# EAGLE design portalgate (EAGLE 7.6.0)
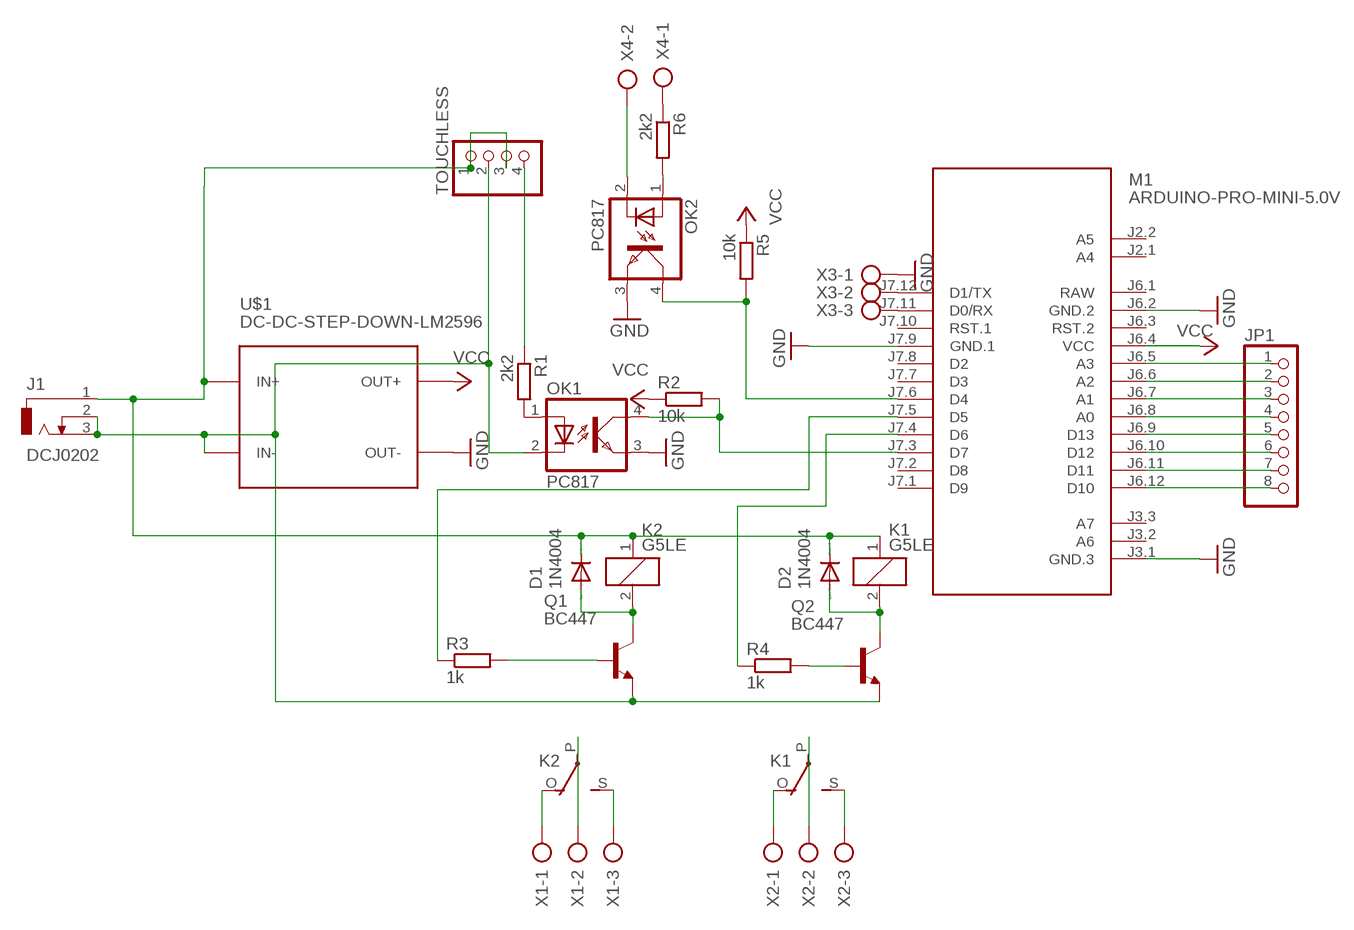
[diagram p0: schematic, sheet 1]

## Parts
D1  1N4004  [DO41-10]
D2  1N4004  [DO41-10]
J1  DCJ0202  [DCJ0202]
JP1  PINHD-1X8  [1X08]
K1  G5LE  [G5LE]
K2  G5LE  [G5LE]
M1  ARDUINO-PRO-MINI-5.0V  [ARDUINO-PRO-MINI]
OK1  PC817  [DIL04]
OK2  PC817  [DIL04]
Q1  BC447  [TO92-EBC]
Q2  BC447  [TO92-EBC]
R1  2k2  R-EU_0204/7  [0204/7]
R2  10k  R-EU_0204/7  [0204/7]
R3  1k  R-EU_0204/7  [0204/7]
R4  1k  R-EU_0204/7  [0204/7]
R5  10k  R-EU_0204/7  [0204/7]
R6  2k2  R-EU_0204/7  [0204/7]
TOUCHLESS  PINHD-1X4  [1X04]
U$1  DC-DC-STEP-DOWN-LM2596  [DC-DC-STEP-DOWN-LM2596]
X1  AK300/3  [AK300/3]
X2  AK300/3  [AK300/3]
X3  AK300/3  [AK300/3]
X4  AK300/2  [AK300/2]

## Nets
+12V: D1.C D2.C J1.1 K1.1 K2.1 TOUCHLESS.1 TOUCHLESS.3 U$1.IN+
GND: M1.J3.1(GND.3) M1.J6.2(GND.2) M1.J7.9(GND.1) OK1.3(EMIT) OK2.3(EMIT) U$1.OUT- X3.1
GND12V: J1.2 J1.3 OK1.2(C) Q1.E Q2.E TOUCHLESS.2 U$1.IN-
N$1: M1.J7.11(D0/RX) X3.3
N$2: M1.J7.12(D1/TX) X3.2
N$3: R1.1 TOUCHLESS.4
N$4: OK1.1(A) R1.2
N$5: D2.A K1.2 Q2.C
N$6: M1.J7.6(D4) OK2.4(COL) R5.2
N$7: M1.J7.5(D5) R3.1
N$8: M1.J7.4(D6) R4.1
N$9: Q1.B R3.2
N$10: JP1.1 M1.J6.5(A3)
N$11: K2.O(2:O) X1.1
N$12: K2.P(2:P) X1.2
N$13: K2.S(2:S) X1.3
N$14: K1.P(2:P) X2.2
N$15: K1.O(2:O) X2.1
N$16: K1.S(2:S) X2.3
N$17: Q2.B R4.2
N$18: D1.A K2.2 Q1.C
N$19: JP1.2 M1.J6.6(A2)
N$20: JP1.3 M1.J6.7(A1)
N$21: JP1.4 M1.J6.8(A0)
N$22: JP1.5 M1.J6.9(D13)
N$23: JP1.6 M1.J6.10(D12)
N$24: JP1.7 M1.J6.11(D11)
N$25: JP1.8 M1.J6.12(D10)
N$26: M1.J7.3(D7) OK1.4(COL) R2.2
N$27: OK2.1(A) R6.2
N$28: R6.1 X4.1
N$29: OK2.2(C) X4.2
VCC: M1.J6.4(VCC) R2.1 R5.1 U$1.OUT+
Unconnected: M1.J2.1(A4) M1.J2.2(A5) M1.J3.2(A6) M1.J3.3(A7) M1.J6.3(RST.2) M1.J7.1(D9) M1.J7.2(D8) M1.J7.7(D3) M1.J7.8(D2) M1.J7.10(RST.1)

## Power pins joined to a net without a drawn wire
RAW: M1.J6.1(RAW)

## Library data of the parts
D1 D2 = diode:1N4004: DIODE general purpose rectifier, 1 A
J1 = con-jack:DCJ0202: DC POWER JACK Source: DCJ0202.pdf; OC_FARNELL: unknown; OC_NEWARK: unknown
JP1 = pinhead:PINHD-1X8: PIN HEADER
K1 K2 = relay:G5LE: RELAY 1 x switch, 10 A/120 V AC, 8 A/30 V DC, Omron; OC_FARNELL: unknown; OC_NEWARK: unknown
M1 = diy-modules:ARDUINO-PRO-MINI-*: Arduino Pro Mini and compatible devices More details available here: https://www.arduino.cc/en/Main/ArduinoBoardProMini Click here to find device on ebay.com <http://www.ebay.com/sch/arduino+pro+mini>
OK1 OK2 = optocoupler:PC817: SHARP OPTO COUPLER; MPN: PC817X4J000F; OC_FARNELL: 9707727; OC_NEWARK: 97K7059
Q1 Q2 = transistor-npn:BC447*: NPN Transistor
R1-R6 = rcl:R-EU_: RESISTOR, European symbol
TOUCHLESS = pinhead:PINHD-1X4: PIN HEADER
U$1 = diy-modules:DC-DC-STEP-DOWN-LM2596: DC/DC Step-Down Regulator based on LM2596-ADJ chip LM2596 datasheet available here: http://www.ti.com/lit/ds/symlink/lm2596.pdf Click here to find device on ebay.com <http://www.ebay.com/sch/lm2596+power+regulator>
X1-X3 = con-ptr500:AK300/3: CONNECTOR; OC_FARNELL: unknown; OC_NEWARK: unknown
X4 = con-ptr500:AK300/2: CONNECTOR; OC_FARNELL: unknown; OC_NEWARK: unknown

## Board
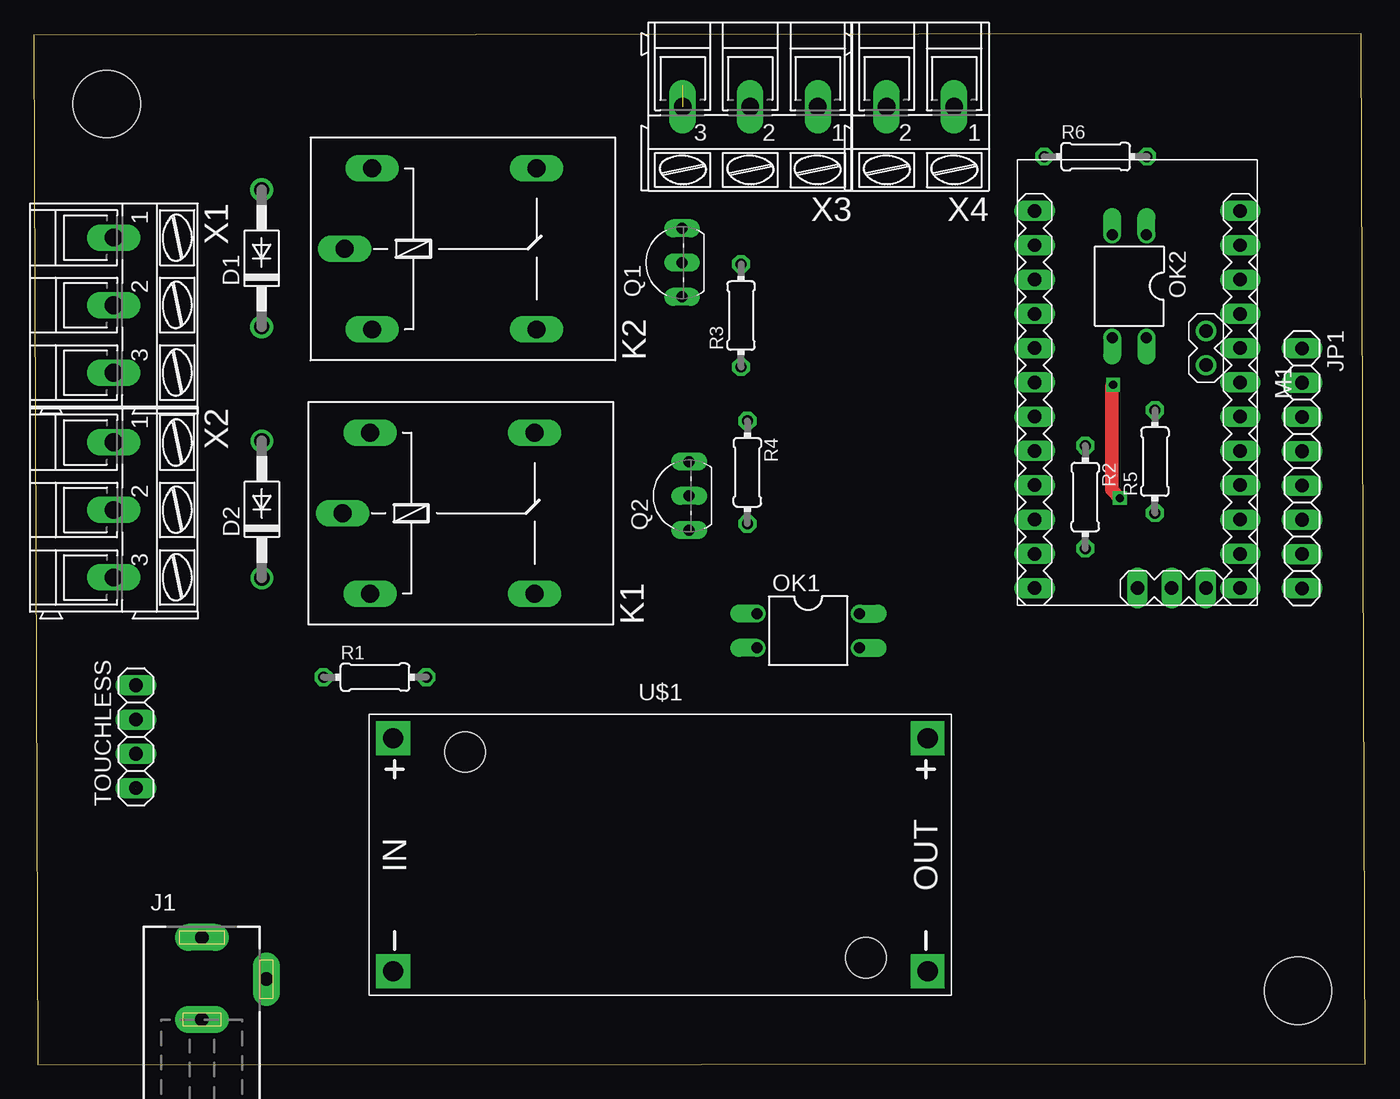
[diagram p1: board, top side]
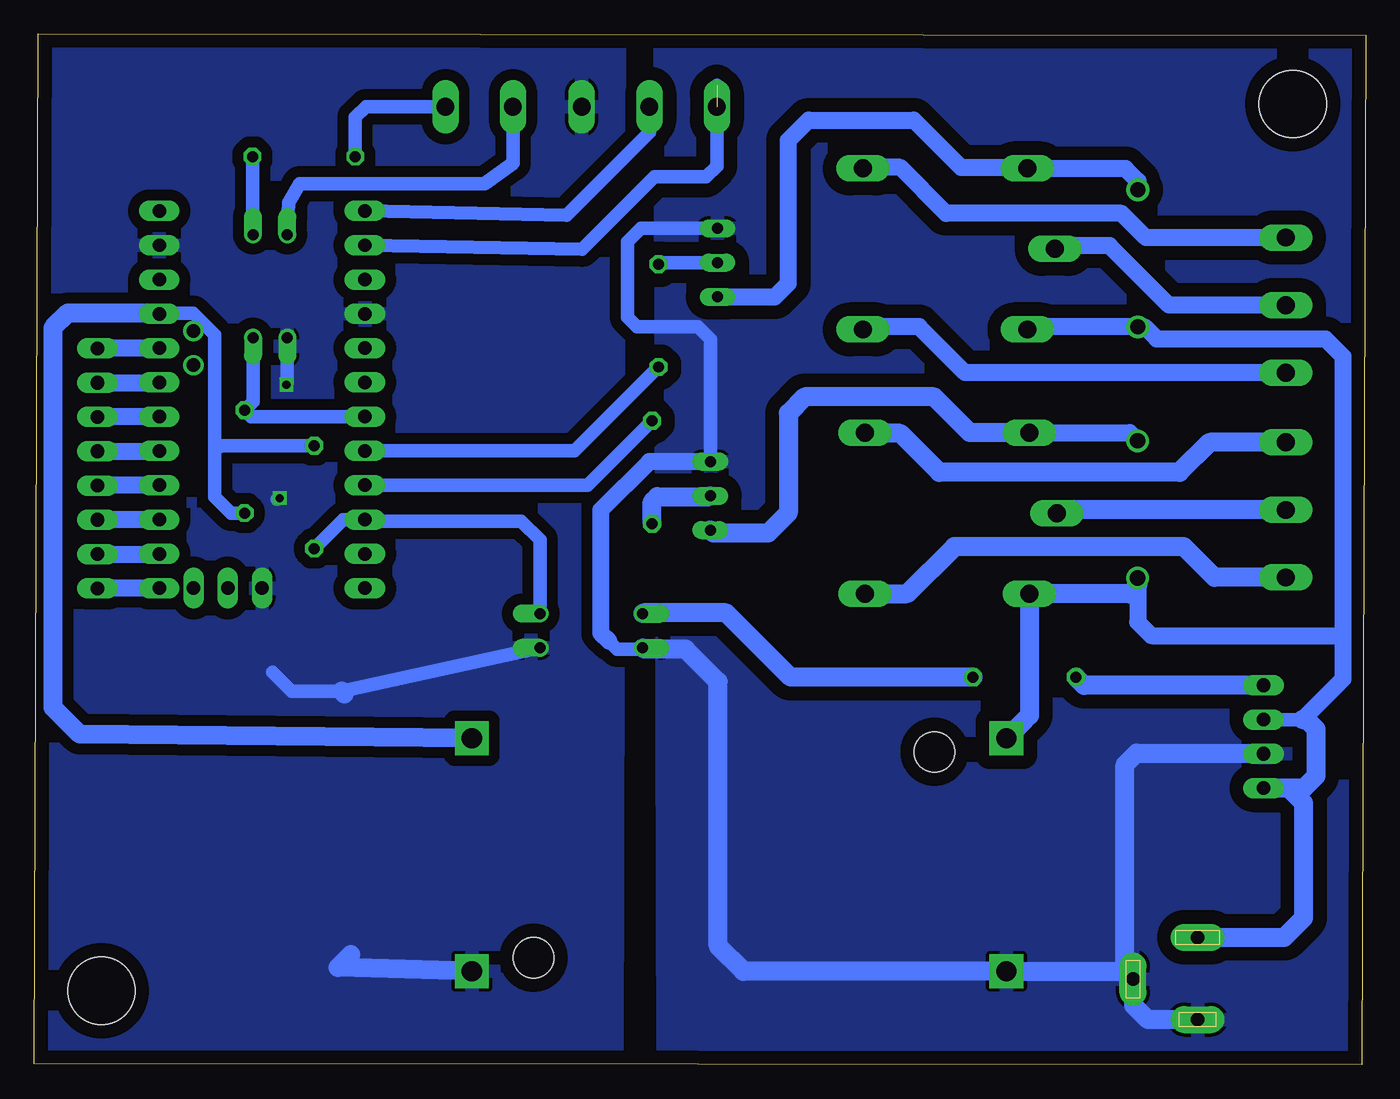
[diagram p2: board, bottom side, seen from below]

Size 98.7 x 76.4 mm. Coordinates in mm from the lower left corner, seen from the top.
Outline: 0.3,0 98.7,0.1 98.4,76.4 0,76.3 0.3,0
Copper layers (1*16): Top 0.035mm / dielectric 1.5mm / Bottom 0.035mm
Design rules "default": minimum track width 10mil, minimum drill 24mil, track to track 8mil, track to pad 8mil, pad to pad 8mil, via to via 8mil, smd to smd 8mil, copper to edge 40mil, drill to drill 8mil, minimum pad ring 10mil, minimum via ring 8mil, stop-mask expansion 4mil, vias tented up to drill 0mil, thermal gap 10mil
Holes 5 mm at 5.4,71.2 93.7,5.5

### Footprints (pad centres in the part's own frame; a part is rotated, then mirrored left to right if it is on the bottom)
DO41-10 = drill 1.118: A 5.08,0; C -5.08,0
DCJ0202 = drill 1 pad 2 long: 1 0,3.1; 2 4.8,0; 3 0,-3
1X08 = drill 1.016 long: 1 -8.89,0; 2 -6.35,0; 3 -3.81,0; 4 -1.27,0; 5 1.27,0; 6 3.81,0; 7 6.35,0; 8 8.89,0
G5LE = drill 1.321 long: 1 -7.493,-5.969; 2 -7.493,5.969; O 4.699,5.969; P -9.525,0; S 4.699,-5.969
ARDUINO-PRO-MINI = drill 1: J2.1 -1.27,5.08; J2.2 -3.81,5.08 | drill 1 long: J3.1 15.24,0; J3.2 15.24,2.54; J3.3 15.24,5.08; J6.1 -12.7,7.62; J6.2 -10.16,7.62; J6.3 -7.62,7.62; J6.4 -5.08,7.62; J6.5 -2.54,7.62; J6.6 0,7.62; J6.7 2.54,7.62; J6.8 5.08,7.62; J6.9 7.62,7.62; J6.10 10.16,7.62; J6.11 12.7,7.62; J6.12 15.24,7.62; J7.1 15.24,-7.62; J7.2 12.7,-7.62; J7.3 10.16,-7.62; J7.4 7.62,-7.62; J7.5 5.08,-7.62; J7.6 2.54,-7.62; J7.7 0,-7.62; J7.8 -2.54,-7.62; J7.9 -5.08,-7.62; J7.10 -7.62,-7.62; J7.11 -10.16,-7.62; J7.12 -12.7,-7.62
DIL04 = drill 0.813 offset: 1 -1.27,-3.81; 2 1.27,-3.81; 3 1.27,3.81; 4 -1.27,3.81
TO92-EBC = drill 0.813 long: B 0,-1.27; C -2.54,-1.27; E 2.54,-1.27
0204/7 = drill 0.813 octagon: 1 -3.81,0; 2 3.81,0
1X04 = drill 1.016 long: 1 -3.81,0; 2 -1.27,0; 3 1.27,0; 4 3.81,0
DC-DC-STEP-DOWN-LM2596 = drill 1.5 pad 2.5 square: IN+ -19.812,8.636; IN- -19.812,-8.636; OUT+ 19.812,8.636; OUT- 19.812,-8.636 | hole 3: -14.478,7.62; 15.24,-7.62
AK300/3 = drill 1.321 long: 1 -5.004,0; 2 0,0; 3 5.004,0
AK300/2 = drill 1.321 long: 1 -2.515,0; 2 2.489,0

### Placement (x,y rotation side)
D1  16.89,59.76 90 top
D2  16.91,41.16 90 top
J1  12.46,6.35 0 top
JP1  94,44.2 270 top
K1  32.42,40.88 0 top
K2  32.57,60.46 0 top
M1  81.8,50.57 270 top
OK1  57.4,32.17 270 top
OK2  81.2,57.7 180 top
Q1  46.77,59.44 90 top
Q2  47.31,42.16 90 top
R1  25.29,28.73 0 top
R2  77.93,42.07 270 top
R3  52.42,55.52 90 top
R4  52.89,43.91 270 top
R5  83.1,44.7 90 top
R6  78.7,67.3 0 top
TOUCHLESS  7.57,24.32 90 top
U$1  46.44,15.57 0 top
X1  5.93,56.3 270 top
X2  5.93,41.12 270 top
X3  53.1,71 180 top
X4  65.7,71 180 top

### Tracks (layer width: path | path; a pad name or v marks a point on that pad's centre or on a via)
+12V  (1 unrouted)
  Bottom 1.016: 4.7,25.59 TOUCHLESS.3
  Bottom 1.27: K2.1 24.89,54.68 D1.C 16.38,54.68 15.5,53.8 3,53.8 1.7,52.5 1.7,31.7 | 1.7,31.7 1.7,28.59 4.7,25.59 | 16.91,35.49 16.91,32.81 15.9,31.8 1.8,31.8 1.7,31.7
  Bottom 1.422: 4.7,25.59 4.39,25.59 3.7,24.9 3.7,21.4 4.6,20.5 5.7,20.5 | 5.7,20.5 TOUCHLESS.1 | 25.24,25.59 U$1.IN+ 24.93,25.91 K1.1 24.92,34.9 17.5,34.9 16.91,35.49 D2.C | J1.1 6.05,9.45 4.6,10.9 4.6,19.4 5.7,20.5
GND  (via drill 0.6 pad 1.02)
  Top 1.016: v80,50.4 79.9,50.3 79.9,42.6 v80.5,42
  Bottom 1.016: OK1.3 75.9,27.7 79.6,27.7 81,29.1 | 81.7,35.23 M1.J3.1 | OK2.3 79.93,50.47 v80,50.4 | v80.5,42 80.6,42 80.7,41.9
  Bottom 1.422: U$1.OUT- 76.17,7.23 75.2,8.2 | 75.7,27.5 75.9,27.7
  pour Bottom (isolate 0.813): 55.5,0.1 98.8,0.2 98.6,75.6 55.3,75.9
GND12V
  Bottom 1.016: 53.49,30.8 55.5,30.8 56.1,31.4 56.5,31.8 | Q2.E 48.58,53.78 49.5,54.7 54,54.7 54.7,55.4 54.7,61 53.7,62 48.06,62 Q1.E
  Bottom 1.27: Q2.E 53.1,44.7 56.7,41.1 56.7,32 56.1,31.4
  Bottom 1.422: OK1.2 53.49,30.8 50.4,30.8 48,28.4 48,8.8 46.13,6.93 U$1.IN- 17.84,6.93 | J1.3 16.15,3.35 17.2,4.4 17.2,6.29 J1.2 17.84,6.93 | 17.84,6.93 17.84,22.26 17,23.1 7.62,23.1 TOUCHLESS.2
  pour Bottom (isolate 1.016): 0.2,-0.1 0,76 52.3,76.3 52.1,0.2 15.8,-0.1
N$1  (1 unrouted)
  Bottom 1.016: M1.J7.11 58.07,60.43 52.7,65.8 48.9,65.8 48.1,66.6 48.1,72.6
N$2
  Bottom 1.016: M1.J7.12 59.23,62.97 53.1,69.1 X3.2
N$3
  Bottom 1.422: TOUCHLESS.4 20.88,28.13 R1.1
N$4
  Bottom 1.422: R1.2 42.63,28.73 47.4,33.5 53.53,33.5 OK1.1
N$5
  Bottom 1.27: K1.2 17.52,46.85 D2.A
  Bottom 1.422: K1.2 29.35,46.85 32,49.5 41.6,49.5 42.8,48.3 42.8,40.9 44.3,39.4 48.36,39.4 Q2.C
N$6
  Bottom 1.016: M1.J7.6 82.62,48.03 R5.2 82.47,49.14 OK2.4
N$7
  Bottom 1.016: M1.J7.5 58.64,45.49 R3.1
N$8
  Bottom 1.016: M1.J7.4 57.66,42.95 R4.1
N$9
  Bottom 1.016: Q1.B 52.31,59.44 R3.2
N$10
  Bottom 1.27: M1.J6.5 93.98,53.11 JP1.1
N$11
  Bottom 1.27: X1.1 16.3,61.3 18.1,63.1 31.1,63.1 34.5,66.5 37.2,66.5 K2.O
N$12
  Bottom 1.27: X1.2 14.59,56.3 19,60.7 22.8,60.7 K2.P
N$13
  Bottom 1.27: X1.3 29.69,51.29 33.1,54.7 37.06,54.7 K2.S
N$14
  Bottom 1.422: X2.2 22.66,41.12 K1.P
N$15
  Bottom 1.422: X2.1 11.58,46.12 13.8,43.9 31.6,43.9 34.5,46.8 37.07,46.8 K1.O
N$16
  Bottom 1.422: K1.S 33.99,34.91 30.5,38.4 13.5,38.4 11.22,36.12 X2.3
N$17
  Bottom 1.422: R4.2 52.89,41.71 52.5,42.1 48.64,42.1 Q2.B
N$18
  Bottom 1.27: Q1.C 43.8,56.9 42.8,57.9 42.8,68.5 41.3,70 33.5,70 30,66.5 25.15,66.5 K2.2 25.05,66.4 17.8,66.4 16.89,65.49 D1.A
N$19
  Bottom 1.27: JP1.2 89.44,50.55 M1.J6.6
N$20
  Bottom 1.27: M1.J6.7 93.98,48.03 JP1.3
N$21
  Bottom 1.27: JP1.4 89.44,45.47 M1.J6.8
N$22
  Bottom 1.27: M1.J6.9 93.98,42.95 JP1.5
N$23
  Bottom 1.27: M1.J6.10 93.98,40.41 JP1.6
N$24
  Bottom 1.27: JP1.7 89.44,37.85 M1.J6.11
N$25
  Bottom 1.27: M1.J6.12 93.98,35.33 JP1.8
N$26
  Bottom 1.016: OK1.4 61.21,38.89 61.2,38.9 62.6,40.3 74.07,40.3 M1.J7.3 75.78,40.41 R2.2
N$27
  Bottom 1.016: R6.2 82.51,61.55 OK2.1
N$28
  Bottom 1.016: X4.1 74.1,71 74.9,70.2 R6.1
N$29
  Bottom 1.016: OK2.2 79.83,63.87 79,65.3 65.3,65.3 63.2,66.8 X4.2
VCC
  Bottom 1.016: R5.1 84.09,40.89 85.3,42.1 85.3,45.5 | 85.3,45.5 85.3,54.1 86.9,55.7 89.37,55.7 M1.J6.4 | R2.1 84.92,45.88 85.3,45.5
  Bottom 1.422: M1.J6.4 89.47,55.7 96.2,55.7 97.3,54.6 97.3,26.5 95.31,24.51 U$1.OUT+